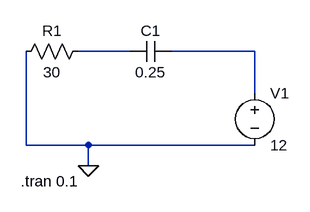
[diagram p0: schematic rc circuit.asc]
rc circuit.asc, the LTspice schematic file:
Version 4.1
SHEET 1 880 680
WIRE 224 112 144 112
WIRE 416 112 288 112
WIRE 416 176 416 112
WIRE 64 256 64 112
WIRE 160 256 64 256
WIRE 416 256 160 256
WIRE 160 288 160 256
FLAG 160 288 0
SYMBOL res 160 96 R90
WINDOW 0 0 56 VBottom 2
WINDOW 3 32 56 VTop 2
SYMATTR InstName R1
SYMATTR Value 30
SYMBOL cap 288 96 R90
WINDOW 0 0 32 VBottom 2
WINDOW 3 32 32 VTop 2
SYMATTR InstName C1
SYMATTR Value 0.25
SYMBOL voltage 416 160 R0
WINDOW 123 0 0 Left 0
WINDOW 39 0 0 Left 0
SYMATTR InstName V1
SYMATTR Value 12
TEXT 56 312 Left 2 !.tran 0.1

The netlist it stands for:
* rc circuit.asc
R1 N001 0 30
C1 N002 N001 0.25
V1 N002 0 12
.tran 0.1
.backanno
.end